# EAGLE schematic xr_vco_components_preroute3 (EAGLE 7.3.0)
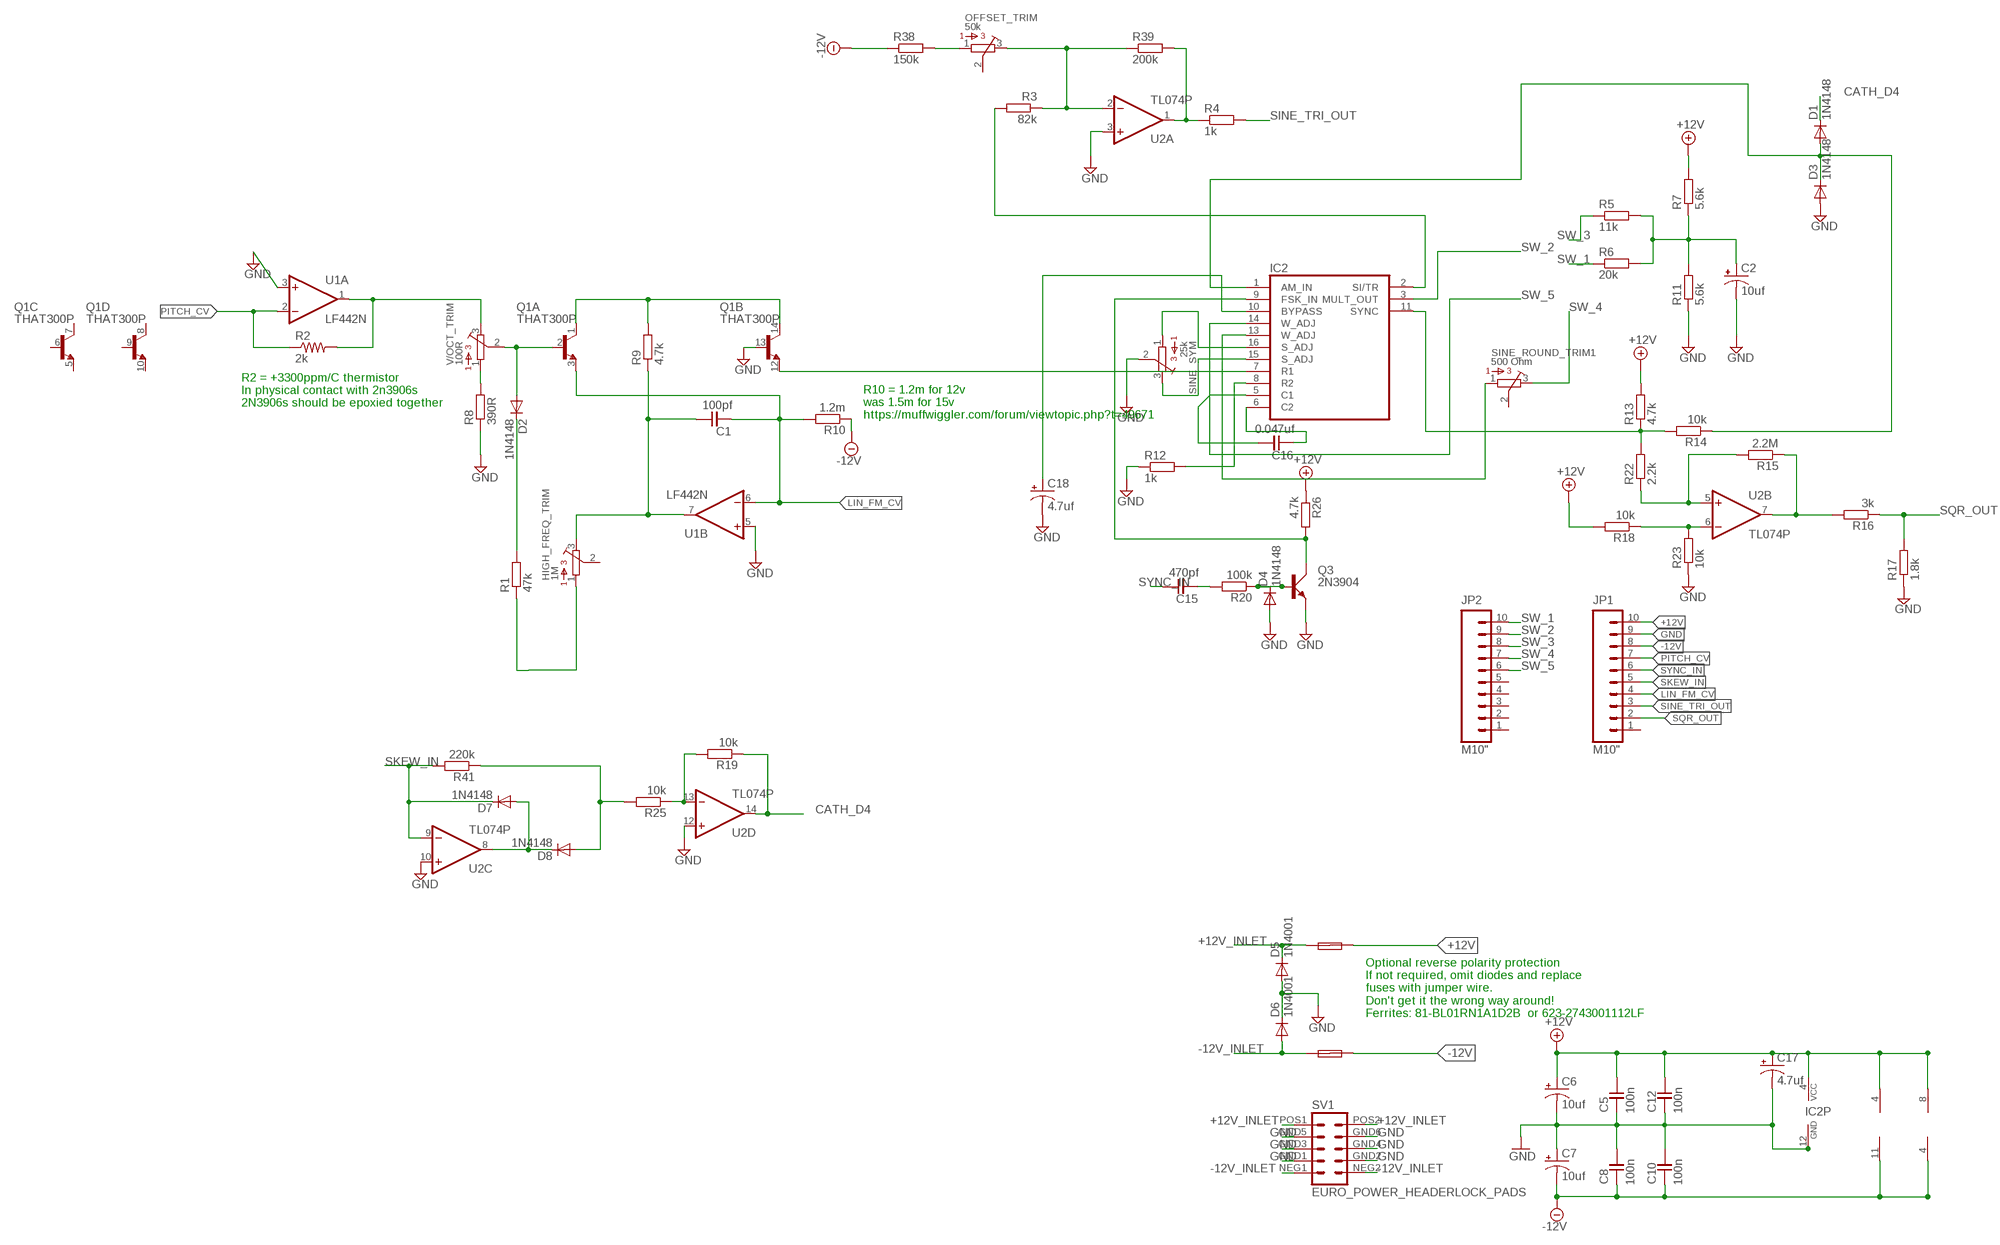
[diagram p0: schematic, sheet 1]

## Parts
C1  100pf  C-EU050-024X044  [C050-024X044]
C2  10uf  CAP_POLPTH2  [CPOL-RADIAL-10UF-25V]
C5  100n  C-EU050-024X044  [C050-024X044]
C6  10uf  CAP_POLPTH2  [CPOL-RADIAL-10UF-25V]
C7  10uf  CAP_POLPTH2  [CPOL-RADIAL-10UF-25V]
C8  100n  C-EU050-024X044  [C050-024X044]
C10  100n  C-EU050-024X044  [C050-024X044]
C12  100n  C-EU050-024X044  [C050-024X044]
C15  470pf  C-EU050-024X044  [C050-024X044]
C16  0.047uf  C-EU050-024X044  [C050-024X044]
C17  4.7uf  CAP_POLPTH2  [CPOL-RADIAL-10UF-25V]
C18  4.7uf  CAP_POLPTH2  [CPOL-RADIAL-10UF-25V]
D1  1N4148  SMALL_DIODEDO35-7  [DO35-7]
D2  1N4148  SMALL_DIODEDO35-7  [DO35-7]
D3  1N4148  SMALL_DIODEDO35-7  [DO35-7]
D4  1N4148  SMALL_DIODEDO35-7  [DO35-7]
D5  1N4001  1N4004  [DO41-10]
D6  1N4001  1N4004  [DO41-10]
D7  1N4148  SMALL_DIODEDO35-7  [DO35-7]
D8  1N4148  SMALL_DIODEDO35-7  [DO35-7]
F1  FUSE  PTC_FUSEPOLY_FUSE  [C050H075X075]
F2  FUSE  PTC_FUSEPOLY_FUSE  [C050H075X075]
HIGH_FREQ_TRIM  1M  BOURNS_3362P_TRIMMERP  [BOURNS_3362P_TRIMMER]
IC2  XR-2206  [DIL16]
JP1  M10"  [1X10]
JP2  M10"  [1X10]
OFFSET_TRIM  50k  BOURNS_3362P_TRIMMERP  [BOURNS_3362P_TRIMMER]
Q1  THAT300P  [DIL14]
Q3  2N3904  [TO92D]
R1  47k  RESISTOR7MM  [7MM_RESISTOR]
R2  2k  R-US_0309/12  [0309/12]
R3  82k  RESISTOR7MM  [7MM_RESISTOR]
R4  1k  RESISTOR7MM  [7MM_RESISTOR]
R5  11k  RESISTOR7MM  [7MM_RESISTOR]
R6  20k  RESISTOR7MM  [7MM_RESISTOR]
R7  5.6k  RESISTOR7MM  [7MM_RESISTOR]
R8  390R  RESISTOR7MM  [7MM_RESISTOR]
R9  4.7k  RESISTOR7MM  [7MM_RESISTOR]
R10  1.2m  RESISTOR7MM  [7MM_RESISTOR]
R11  5.6k  RESISTOR7MM  [7MM_RESISTOR]
R12  1k  RESISTOR7MM  [7MM_RESISTOR]
R13  4.7k  RESISTOR7MM  [7MM_RESISTOR]
R14  10k  RESISTOR7MM  [7MM_RESISTOR]
R15  2.2M  RESISTOR7MM  [7MM_RESISTOR]
R16  3k  RESISTOR7MM  [7MM_RESISTOR]
R17  1.8k  RESISTOR7MM  [7MM_RESISTOR]
R18  10k  RESISTOR7MM  [7MM_RESISTOR]
R19  10k  RESISTOR7MM  [7MM_RESISTOR]
R20  100k  RESISTOR7MM  [7MM_RESISTOR]
R22  2.2k  RESISTOR7MM  [7MM_RESISTOR]
R23  10k  RESISTOR7MM  [7MM_RESISTOR]
R25  10k  RESISTOR7MM  [7MM_RESISTOR]
R26  4.7k  RESISTOR7MM  [7MM_RESISTOR]
R38  150k  RESISTOR7MM  [7MM_RESISTOR]
R39  200k  RESISTOR7MM  [7MM_RESISTOR]
R41  220k  RESISTOR7MM  [7MM_RESISTOR]
SINE_ROUND_TRIM1  500 Ohm  BOURNS_3362P_TRIMMERP  [BOURNS_3362P_TRIMMER]
SINE_SYM  25k  BOURNS_3362P_TRIMMERP  [BOURNS_3362P_TRIMMER]
SV1  EURO_POWER_HEADERLOCK_PADS  [EURO_PWR_HEADER_LOCK]
U1  LF442N  [DIL08]
U2  TL074P  [DIL14]
V/OCT_TRIM  100R  BOURNS_3362P_TRIMMERP  [BOURNS_3362P_TRIMMER]

## Nets
+12V: C5.1 C6.1(+) C12.1 C17.1(+) F1.2 IC2.4(VCC) JP1.10 R7.2 R13.2 R18.2 R26.1 U1.8(P:V+) U2.4(P:V+)
+12V_INLET [power]: D5.C F1.1 SV1.POS1 SV1.POS2
-12V: C7.2(-) C8.2 C10.2 F2.2 JP1.8 R10.1 R38.1 U1.4(P:V-) U2.11(P:V-)
-12V_INLET [power]: D6.A F2.1 SV1.NEG1 SV1.NEG2
CATH_D4: D1.C R19.1 U2.14(D:OUT)
GND: C2.2(-) C5.2 C6.2(-) C7.1(+) C8.1 C10.1 C12.2 C17.2(-) C18.2(-) D3.A D4.A D5.A D6.C IC2.12(GND) JP1.9 Q1.13(B:B) Q3.E R8.1 R11.1 R12.1 R17.1 R23.1 SINE_SYM.2 SV1.GND1 SV1.GND2 SV1.GND3 SV1.GND4 SV1.GND5 SV1.GND6 U1.3(A:+IN) U1.5(B:+IN) U2.3(A:+IN) U2.10(C:+IN) U2.12(D:+IN)
LIN_FM_CV: C1.2 JP1.4 Q1.3(A:E) R10.2 U1.6(B:-IN)
N$1: IC2.7(R1) Q1.12(B:E)
N$2: D2.C R1.2
N$3: HIGH_FREQ_TRIM.1 R1.1
N$5: IC2.2(SI/TR) R3.2
N$7: R2.2 U1.1(A:OUT) V/OCT_TRIM.3
N$8: OFFSET_TRIM.3 R3.1 R39.1 U2.2(A:-IN)
N$9: R8.2 V/OCT_TRIM.1
N$10: D2.A Q1.2(A:B) V/OCT_TRIM.2
N$11: Q1.1(A:C) Q1.14(B:C) R9.2
N$12: OFFSET_TRIM.1 R38.2
N$13: R4.1 R39.2 U2.1(A:OUT)
N$15: C1.1 HIGH_FREQ_TRIM.3 R9.1 U1.7(B:OUT)
N$16: C2.1(+) R5.2 R6.2 R7.1 R11.2
N$17: IC2.16(S_ADJ) SINE_SYM.1
N$20: IC2.13(W_ADJ) SINE_ROUND_TRIM1.1
N$21: IC2.15(S_ADJ) SINE_SYM.3
N$22: IC2.8(R2) R12.2
N$23: R18.1 R23.2 U2.6(B:-IN)
N$24: R15.1 R16.2 U2.7(B:OUT)
N$25: R19.2 R25.1 U2.13(D:-IN)
N$26: R15.2 R22.1 U2.5(B:+IN)
N$27: D1.A D3.C IC2.1(AM_IN) R14.1
N$28: C15.2 R20.2
N$29: D4.C Q3.B R20.1
N$30: IC2.11(SYNC) R13.1 R14.2 R22.2
N$31: IC2.9(FSK_IN) Q3.C R26.2
N$32: C16.2 IC2.6(C2)
N$33: C16.1 IC2.5(C1)
N$34: C18.1(+) IC2.10(BYPASS)
N$35: D7.A D8.C U2.8(C:OUT)
N$36: D8.A R25.2 R41.1
PITCH_CV: JP1.7 R2.1 U1.2(A:-IN)
SINE_TRI_OUT: JP1.3 R4.2
SKEW_IN: D7.C JP1.5 R41.2 U2.9(C:-IN)
SQR_OUT: JP1.2 R16.1 R17.2
SW_1: JP2.10 R6.1
SW_2: IC2.3(MULT_OUT) JP2.9
SW_3: JP2.8 R5.1
SW_4: JP2.7 SINE_ROUND_TRIM1.3
SW_5: IC2.14(W_ADJ) JP2.6
SYNC_IN: C15.1 JP1.6
Unconnected: HIGH_FREQ_TRIM.2 JP1.1 JP2.1 JP2.2 JP2.3 JP2.4 JP2.5 OFFSET_TRIM.2 Q1.5(C:E) Q1.6(C:B) Q1.7(C:C) Q1.8(D:C) Q1.9(D:B) Q1.10(D:E) SINE_ROUND_TRIM1.2

## Notes on the sheet
- R2 = +3300ppm/C thermistor
  In physical contact with 2n3906s
  2N3906s should be epoxied together
- R10 = 1.2m for 12v
  was 1.5m for 15v
  https://muffwiggler.com/forum/viewtopic.php?t=49671
- Optional reverse polarity protection
  If not required, omit diodes and replace
  fuses with jumper wire. 
  Don't get it the wrong way around! 
  Ferrites: 81-BL01RN1A1D2B  or 623-2743001112LF

## Library data of the parts
C1 C5 C8 C10 C12 C15 C16 = TomW:C-EU: CAPACITOR, European symbol
C2 C6 C7 C17 C18 = SparkFun-Passives:CAP_POL: Capacitor Polarized These are standard SMD and PTH capacitors. Normally 10uF, 47uF, and 100uF in electrolytic and tantalum varieties. Always verify the external diameter of the through hole cap, it varies with capacity, voltage, and manufacturer. The EIA devices should be standard.
D1-D4 D7 D8 = MusicThingModular:SMALL_DIODE: Small Signal Diode
D5 D6 = diode:1N4004: DIODE general purpose rectifier, 1 A
F1 F2 = TomW:PTC_FUSE
HIGH_FREQ_TRIM OFFSET_TRIM SINE_ROUND_TRIM1 SINE_SYM V/OCT_TRIM = MusicThingModular:BOURNS_3362P_TRIMMER: 3362 Series 1/4" Square Trimmer
IC2 = exar:XR-2206: Monolithic FUNCTION GENERATOR; OC_FARNELL: unknown; OC_NEWARK: unknown
JP1 JP2 = SparkFun-Connectors:M10: Header 10 Standard 10-pin 0.1" header. Use with straight break away headers (SKU : PRT-00116), right angle break away headers (PRT-00553), swiss pins (PRT-00743), machine pins (PRT-00117), and female headers (PRT-00115).
Q1 = that-corp:THAT300: 4-Matched NPN Transistors
Q3 = transistor-small-signal:2N3904: NPN TRANSISTOR
R1 R3-R20 R22 R23 R25 R26 R38 R39 R41 = MusicThingModular:RESISTOR: Standard resistor, various versions
R2 = resistor:R-US_: RESISTOR, American symbol
SV1 = MusicThingModular:EURO_POWER_HEADER: Power Header 10 pin power header for Eurorack Power Supplies Variants with fatter pads for easier soldering, and the LOCK variant which has 5mil offset pins to hold the component in place before soldering
U1 = linear:LF442: OP AMP
U2 = linear:TL074: OP AMP

## Net classes
1 power: width 0.406 mm
2 ground: width 0.305 mm